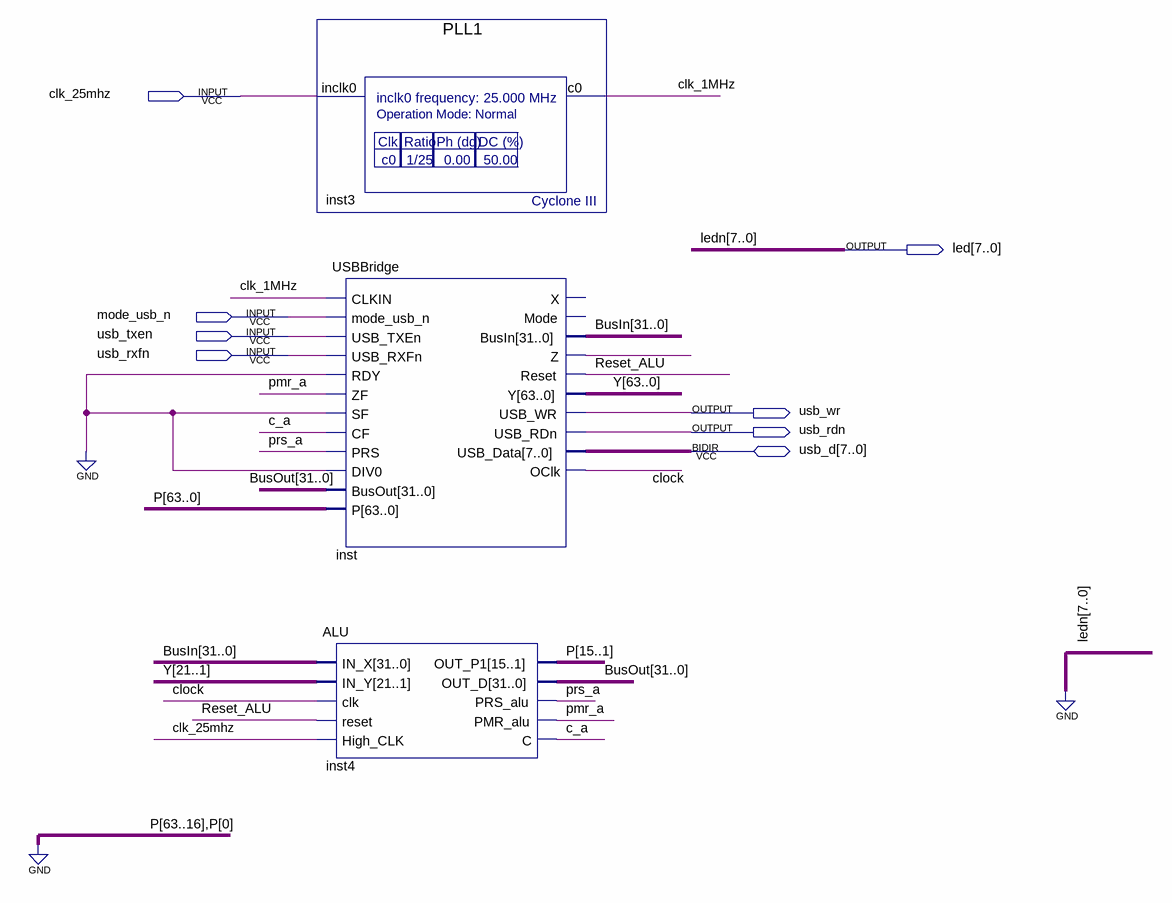
[diagram p0: schematic sheet]
// Quartus schematic Digital_Device_1.bdf as structural Verilog: 3 symbols, 8 pins
module Digital_Device_1 (
  input  clk_25mhz,
  input  mode_usb_n,
  input  usb_txen,
  input  usb_rxfn,
  inout  [7:0] usb_d,
  output [7:0] led,
  output usb_wr,
  output usb_rdn
);

  wire c_a, clk_1MHz, clock, inst_z, pmr_a, prs_a, Reset_ALU;
  wire [15:1] P;
  wire [31:0] BusIn, BusOut;
  wire [63:0] Y;

  PLL1 inst3 (.inclk0(clk_25mhz), .c0(clk_1MHz));
  USBBridge inst (
    .CLKIN(clk_1MHz), .mode_usb_n(mode_usb_n), .USB_TXEn(usb_txen), .USB_RXFn(usb_rxfn), .RDY(1'b0),
    .ZF(pmr_a), .SF(1'b0), .CF(c_a), .PRS(prs_a), .DIV0(1'b0), .BusOut(BusOut), .P({{48{1'b0}}, P, 1'b0}),
    .BusIn(BusIn), .Z(inst_z), .Reset(Reset_ALU), .Y(Y), .USB_WR(usb_wr), .USB_RDn(usb_rdn), .OClk(clock),
    .USB_Data(usb_d));  // open: X, Mode
  ALU inst4 (
    .IN_X(BusIn), .IN_Y(Y[21:1]), .clk(clock), .reset(Reset_ALU), .High_CLK(clk_25mhz), .OUT_P1(P),
    .OUT_D(BusOut), .PRS_alu(prs_a), .PMR_alu(pmr_a), .C(c_a));

  assign led = {8{1'b0}};
endmodule
